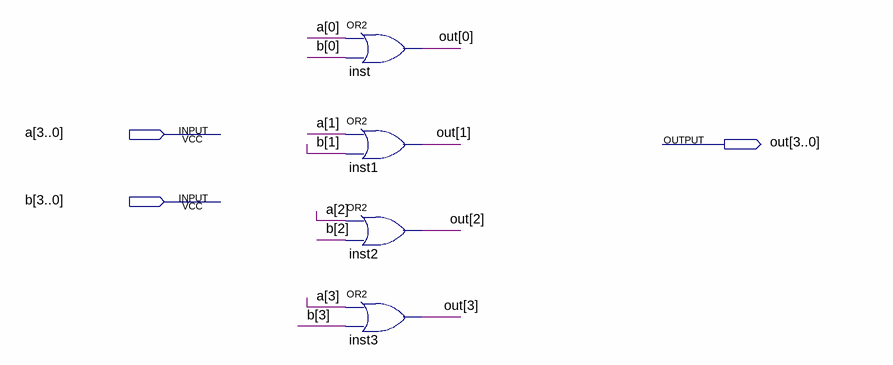
[diagram p0: schematic sheet]
// Quartus schematic or_4bit.bdf as structural Verilog: 4 symbols, 3 pins
module or_4bit (
  input  [3:0] a,
  input  [3:0] b,
  output [3:0] out
);

  or inst (out[0], a[0], b[0]);
  or inst1 (out[1], a[1], b[1]);
  or inst2 (out[2], a[2], b[2]);
  or inst3 (out[3], a[3], b[3]);
endmodule
